# EAGLE design mapleSDuino-V0.9_004-eagle7 (EAGLE 7.6.0)
MAPLE-CUx Large Version
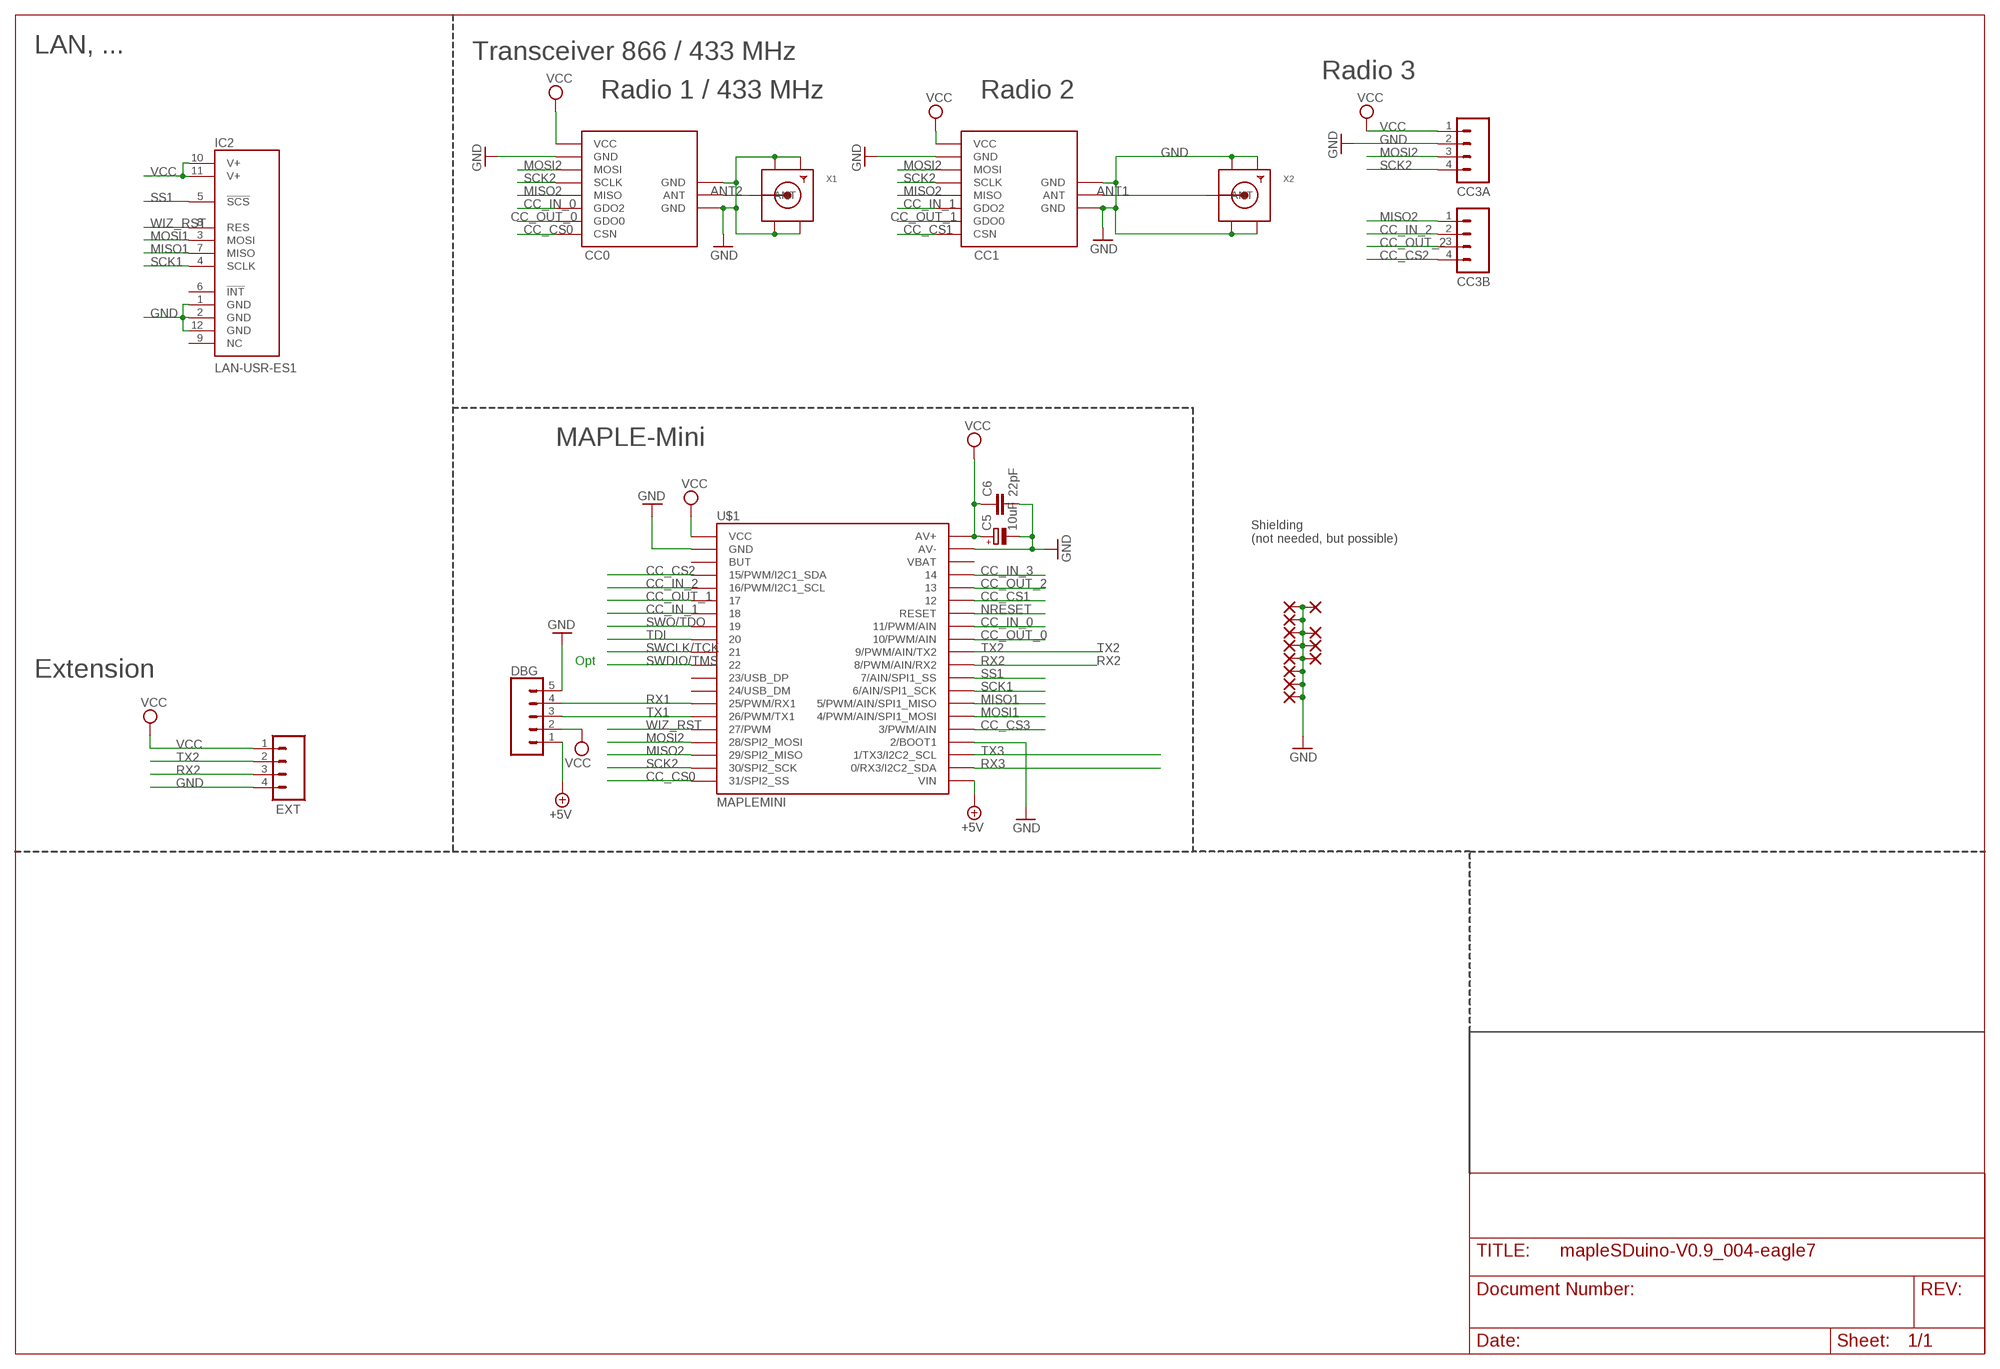
[diagram p0: schematic, sheet 1]

## Parts
C5  10uF  CPOL-EUR/2012-12W  [R/2012-12W]
C6  22pF  C-EUC0805  [C0805]
CC0  CC1101  CC1101_MODULE1SMALL  [CC1101_MODULE1_SMD]
CC1  CC1101_MODULE1SMALL  [CC1101_MODULE1_SMD]
CC3A  CONN_04PTH  [1X04]
CC3B  CONN_04PTH  [1X04]
DBG  CONN_05LOCK  [1X05_LOCK]
EXT  CONN_04PTH  [1X04]
IC2  LAN-USR-ES1  [USR-ES1]
PAD1  WIREPADSMD1,27-254  [SMD1,27-2,54]
PAD2  WIREPADSMD1,27-254  [SMD1,27-2,54]
PAD3  WIREPADSMD1,27-254  [SMD1,27-2,54]
PAD4  WIREPADSMD1,27-254  [SMD1,27-2,54]
PAD5  WIREPADSMD1,27-254  [SMD1,27-2,54]
PAD6  WIREPADSMD1,27-254  [SMD1,27-2,54]
PAD7  WIREPADSMD1,27-254  [SMD1,27-2,54]
PAD8  WIREPADSMD1,27-254  [SMD1,27-2,54]
PAD9  WIREPADSMD1,27-254  [SMD1,27-2,54]
PAD10  WIREPADSMD1,27-254  [SMD1,27-2,54]
PAD11  WIREPADSMD1,27-254  [SMD1,27-2,54]
PAD12  WIREPADSMD1,27-254  [SMD1,27-2,54]
U$1  MAPLEMINI  [20-DIP]
X1  SMACONNECTOR_EDGE  [SMA_EDGELAUNCH]
X2  SMACONNECTOR_EDGE  [SMA_EDGELAUNCH]

## Nets
+5V [PWR]: DBG.1 U$1.21(VIN)
ANT1 [PWR]: CC1.ANT X2.P(ANT)
ANT2: CC0.ANT X1.P(ANT)
CC_CS0: CC0.CSN U$1.20(31/SPI2_SS)
CC_CS1: CC1.CSN U$1.35
CC_CS2: CC3B.4 U$1.4(15/PWM/I2C1_SDA)
CC_CS3: U$1.25(3/PWM/AIN)
CC_IN_0: CC0.GDO2 U$1.33(11/PWM/AIN)
CC_IN_1: CC1.GDO2 U$1.7
CC_IN_2: CC3B.2 U$1.5(16/PWM/I2C1_SCL)
CC_IN_3: U$1.37
CC_OUT_0: CC0.GDO0 U$1.32(10/PWM/AIN)
CC_OUT_1: CC1.GDO0 U$1.6
CC_OUT_2: CC3B.3 U$1.36
GND [PWR]: C5.- C6.2 CC0.GND@0(GND) CC0.GND@1(GND) CC0.GND@2(GND) CC1.GND@0(GND) CC1.GND@1(GND) CC1.GND@2(GND) CC3A.2 DBG.5 EXT.4 IC2.1(GND) IC2.2(GND) IC2.12(GND) PAD1.1(P) PAD2.1(P) PAD3.1(P) PAD4.1(P) PAD5.1(P) PAD6.1(P) PAD7.1(P) PAD8.1(P) PAD9.1(P) PAD10.1(P) PAD11.1(P) PAD12.1(P) U$1.2(GND) U$1.24(2/BOOT1) U$1.39(AV-) X1.GND@1(GND4) X1.GND@2(GND3) X1.GND@3(GND2) X1.GND@4(GND1) X2.GND@1(GND4) X2.GND@2(GND3) X2.GND@3(GND2) X2.GND@4(GND1)
MISO1: IC2.7(MISO) U$1.27(5/PWM/AIN/SPI1_MISO)
MISO2: CC0.MISO CC1.MISO CC3B.1 U$1.18(29/SPI2_MISO)
MOSI1: IC2.3(MOSI) U$1.26(4/PWM/AIN/SPI1_MOSI)
MOSI2: CC0.MOSI CC1.MOSI CC3A.3 U$1.17(28/SPI2_MOSI)
NRESET: U$1.34(RESET)
RX1: DBG.4 U$1.14(25/PWM/RX1)
RX2: EXT.3 U$1.30(8/PWM/AIN/RX2)
RX3: U$1.22(0/RX3/I2C2_SDA)
SCK1: IC2.4(SCLK) U$1.28(6/AIN/SPI1_SCK)
SCK2: CC0.SCLK CC1.SCLK CC3A.4 U$1.19(30/SPI2_SCK)
SS1: IC2.5(!SCS!) U$1.29(7/AIN/SPI1_SS)
SWCLK/TCK: U$1.10
SWDIO/TMS: U$1.11
SWO/TDO: U$1.8
TDI: U$1.9
TX1: DBG.3 U$1.15(26/PWM/TX1)
TX2: EXT.2 U$1.31(9/PWM/AIN/TX2)
TX3: U$1.23(1/TX3/I2C2_SCL)
VCC [PWR]: C5.+ C6.1 CC0.VCC CC1.VCC CC3A.1 DBG.2 EXT.1 IC2.10(V+) IC2.11(V+) U$1.1(VCC) U$1.40(AV+)
WIZ_RST: IC2.8(RES) U$1.16(27/PWM)
Unconnected: IC2.6(!INT!) IC2.9(NC) U$1.3(BUT) U$1.12(23/USB_DP) U$1.13(24/USB_DM) U$1.38(VBAT)

## Notes on the sheet
- LAN, ... | Transceiver 866 / 433 MHz
- Radio 3
- Radio 1 / 433 MHz | Radio 2
- MAPLE-Mini
- Shielding
  (not needed, but possible)
- Opt
- Extension

## Library data of the parts
C5 = rcl:CPOL-EU: POLARIZED CAPACITOR, European symbol
C6 = rcl:C-EU: CAPACITOR, European symbol
CC0 CC1 = Martin-Communication-V4:CC1101_MODULE1: CC1101 wireless module for 433/868 MHz (sold from Aliexpress). DIL version for mounting with pin header (and SMD soldering) and SMD only variant available.
CC3A CC3B EXT = SparkFun-Connectors:CONN_04: Multi connection point. Often used as Generic Header-pin footprint for 0.1 inch spaced/style header connections On any of the 0.1 inch spaced packages, you can populate with these: Break Away Headers - Straight <https://www.sparkfun.com/products/116> (PRT-00116) Break Away Male Headers - Right Angle <https://www.sparkfun.com/products/553> (PRT-00553) Female Headers <https://www.sparkfun.com/products/115> (PRT-00115) Break Away Headers - Machine Pin <https://www.sparkfun.com/products/117> (PRT-00117) Break Away Female Headers - Swiss Machine Pin <https://www.sparkfun.com/products/743> (PRT-00743) For SCREWTERMINALS and SPRING TERMINALS visit here: Screw Terimnals on SparkFun.com <https://www.sparkfun.com/search/results?term=Screw+Terminals> (5mm/3.5mm/2.54mm spacing) This device is also useful as a general connection point to wire up your design to another part of your project. Our various solder wires solder well into these plated through hole pads. Hook-Up Wire - Assortment (Stranded, 22 AWG) <https://www.sparkfun.com/products/11375> (PRT-11375) Hook-Up Wire - Assortment (Solid Core, 22 AWG) <https://www.sparkfun.com/products/11367> (PRT-11367) View the entire wire category on our website here <https://www.sparkfun.com/categories/141> Special notes: Molex polarized connector foot print use with SKU : PRT-08231 with associated crimp pins and housings. 1MM SMD Version SKU: PRT-10208; PROD_ID: CONN-09696
DBG = SparkFun-Connectors:CONN_05: Multi connection point. Often used as Generic Header-pin footprint for 0.1 inch spaced/style header connections On any of the 0.1 inch spaced packages, you can populate with these: Break Away Headers - Straight <https://www.sparkfun.com/products/116> (PRT-00116) Break Away Male Headers - Right Angle <https://www.sparkfun.com/products/553> (PRT-00553) Female Headers <https://www.sparkfun.com/products/115> (PRT-00115) Break Away Headers - Machine Pin <https://www.sparkfun.com/products/117> (PRT-00117) Break Away Female Headers - Swiss Machine Pin <https://www.sparkfun.com/products/743> (PRT-00743) For SCREWTERMINALS and SPRING TERMINALS visit here: Screw Terimnals on SparkFun.com <https://www.sparkfun.com/search/results?term=Screw+Terminals> (5mm/3.5mm/2.54mm spacing) This device is also useful as a general connection point to wire up your design to another part of your project. Our various solder wires solder well into these plated through hole pads. Hook-Up Wire - Assortment (Stranded, 22 AWG) <https://www.sparkfun.com/products/11375> (PRT-11375) Hook-Up Wire - Assortment (Solid Core, 22 AWG) <https://www.sparkfun.com/products/11367> (PRT-11367) View the entire wire category on our website here <https://www.sparkfun.com/categories/141> Special notes: Molex polarized connector foot print use with SKU : PRT-08231 with associated crimp pins and housings. 1MM SMD Version SKU: PRT-10208
IC2 = Martin-Communication:LAN-USR-ES1
PAD1-PAD12 = wirepad:WIREPAD: Wire PAD connect wire on PCB
U$1 = maplemini-small:MAPLEMINI
X1 X2 = adafruit:SMACONNECTOR: SMA Connector 90° DIP SMA Connector, 50 Ohm (4UConnector: 07259)

## Net classes
0 default: width 0.305 mm
1 PWR: width 0.406 mm

## Board
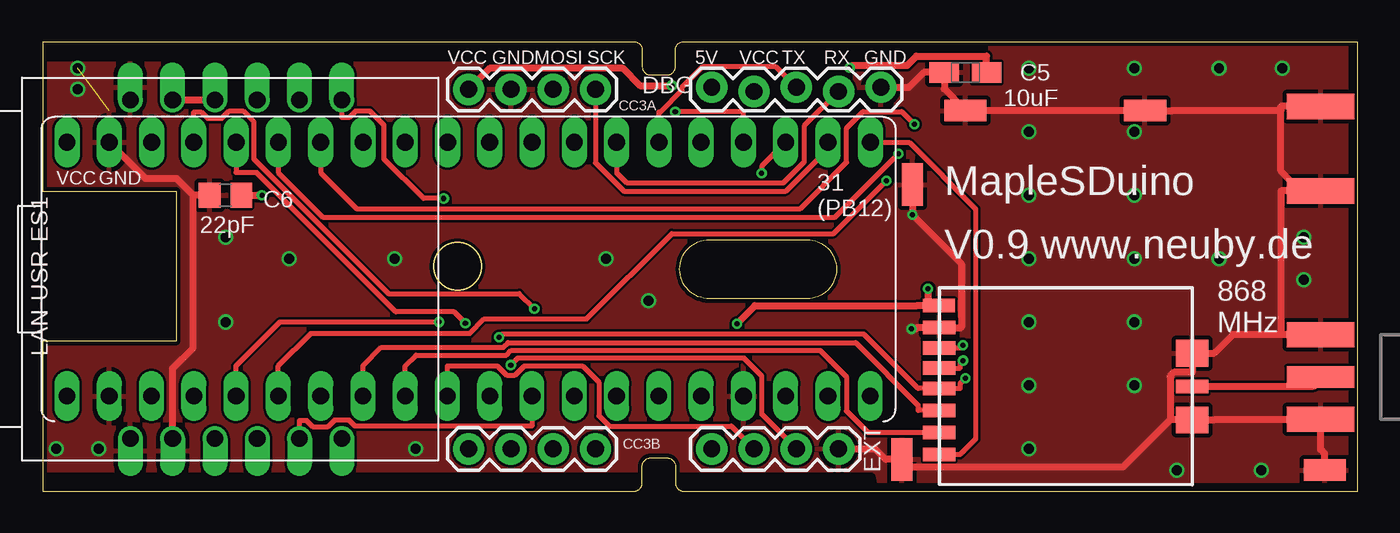
[diagram p1: board, top side]
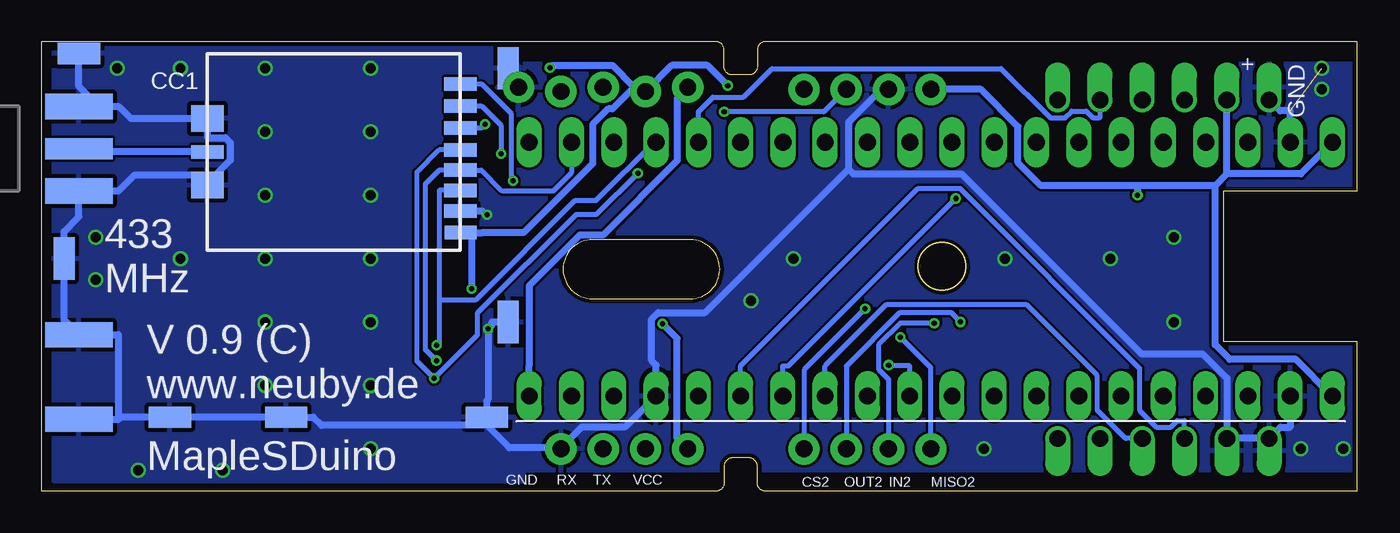
[diagram p2: board, bottom side, seen from below]

Size 79 x 27 mm. Coordinates in mm from the lower left corner, seen from the top.
Outline: 0,0 35.5,0 arc90 36,0.5 36,1.5 arc-90 36.5,2 37.5,2 arc-90 38,1.5 38,0.5 arc90 38.5,0 79,0 79,27 38.5,27 arc90 38,26.5 38,25.5 arc-90 37.5,25 36.5,25 arc-90 36,25.5 36,26.5 arc90 35.5,27 0,27 0,18 8,18 8,9 0,9 0,0
Outline: 40.04,15.11 45.9,15.11 arc-180 45.9,11.56 40.04,11.56 arc-180 40.04,15.11
Outline: circle at 24.9,13.51 radius 1.41
Copper layers (1*16): Top 0.035mm / dielectric 1.5mm / Bottom 0.035mm
Design rules "Fusion_eagle_rule_v1.1": minimum track width 6mil, minimum drill 12mil, track to track 6mil, track to pad 6mil, pad to pad 6mil, via to via 6mil, smd to smd 0mil, copper to edge 10mil, drill to drill 10mil, minimum pad ring 10mil, minimum via ring 6mil, stop-mask expansion 2mil, vias tented up to drill 100mil, thermal gap 10mil
tRestrict: 8 lines
bRestrict: 8 lines

### Footprints (pad centres in the part's own frame; a part is rotated, then mirrored left to right if it is on the bottom)
R/2012-12W = smd 1.75 x 1.26: + 1.275,0; - -1.275,0
C0805 = smd 1.3 x 1.5: 1 -0.95,0; 2 0.95,0
CC1101_MODULE1_SMD = smd 1.93 x 0.813: ANT 14.889,4.381; CSN -0.305,0.305; GDO0 -0.305,1.626; GDO2 -0.305,2.946; GND@0 -0.305,7.925; MISO -0.305,4.267; MOSI -0.305,6.706; SCLK -0.305,5.486; VCC -0.318,9.238 | smd 1.93 x 1.6: GND@1 14.889,6.381; GND@2 14.889,2.381
1X04 = drill 1.016 pad 1.88: 1 0,0; 2 2.54,0; 3 5.08,0; 4 7.62,0
1X05_LOCK = drill 1.016 pad 1.88: 1 0,0.127; 2 2.54,-0.127; 3 5.08,0.127; 4 7.62,-0.127; 5 10.16,0.127
USR-ES1 = drill 1 pad 1.35 offset: 1 -10.16,5.715; 2 -10.16,3.175; 3 -10.16,0.635; 4 -10.16,-1.905; 5 -10.16,-4.445; 6 -10.16,-6.985; 7 10.16,-6.985; 8 10.16,-4.445; 9 10.16,-1.905; 10 10.16,0.635; 11 10.16,3.175; 12 10.16,5.715
SMD1,27-2,54 = smd 1.27 x 2.54: 1 0,0
20-DIP = drill 1.016 pad 1.27 long: 1 -24.13,-7.62; 2 -21.59,-7.62; 3 -19.05,-7.62; 4 -16.51,-7.62; 5 -13.97,-7.62; 6 -11.43,-7.62; 7 -8.89,-7.62; 8 -6.35,-7.62; 9 -3.81,-7.62; 10 -1.27,-7.62; 11 1.27,-7.62; 12 3.81,-7.62; 13 6.35,-7.62; 14 8.89,-7.62; 15 11.43,-7.62; 16 13.97,-7.62; 17 16.51,-7.62; 18 19.05,-7.62; 19 21.59,-7.62; 20 24.13,-7.62 | drill 1 pad 1.27 long: 21 24.13,7.62; 22 21.59,7.62; 23 19.05,7.62; 24 16.51,7.62; 25 13.97,7.62; 26 11.43,7.62; 27 8.89,7.62; 28 6.35,7.62; 29 3.81,7.62; 30 1.27,7.62; 31 -1.27,7.62; 32 -3.81,7.62; 33 -6.35,7.62; 34 -8.89,7.62; 35 -11.43,7.62; 36 -13.97,7.62; 37 -16.51,7.62; 38 -19.05,7.62; 39 -21.59,7.62; 40 -24.13,7.62
SMA_EDGELAUNCH = smd 4.064 x 1.524: GND@1 2.032,-2.54; GND@2 2.032,2.54 | smd 4.064 x 1.524 bottom: GND@3 2.032,2.54; GND@4 2.032,-2.54 | smd 4.064 x 1.27: P 2.032,0

### Placement (x,y rotation side)
C5  55.42,25.15 0 top
C6  10.97,17.78 180 top
CC0  54.15,1.91 0 top
CC1  54.15,24.77 180 bottom
CC3A  25.57,24.13 0 top
CC3B  25.57,2.54 0 top
DBG  40.18,24.13 0 top
EXT  40.18,2.54 0 top
IC2  10.97,13.34 90 top
PAD1  52.24,18.41 0 top
PAD2  77.01,1.27 90 top
PAD3  55.42,22.86 90 top
PAD4  71.3,4.45 270 bottom
PAD5  66.22,22.86 90 top
PAD6  51.61,1.91 0 top
PAD7  64.31,4.45 270 bottom
PAD8  50.98,10.16 0 bottom
PAD9  76.76,26.29 270 bottom
PAD10  77.64,13.97 0 bottom
PAD11  52.24,4.45 270 bottom
PAD12  50.98,25.4 180 bottom
U$1  25.57,13.34 180 bottom
X1  78.79,6.86 180 top
X2  78.79,20.57 0 bottom

### Tracks (layer width: path | path; a pad name or v marks a point on that pad's centre or on a via)
+5V
  Bottom 0.406: DBG.1 40.81,23.62 40.81,19.85 45.29,15.38 46.67,15.38 49.7,12.35 49.7,7.58 U$1.21
ANT1
  Bottom 0.406: CC1.ANT 76.76,20.38 X2.P
ANT2
  Top 0.406: X1.P arc-90 76.18,6.29 CC0.ANT
CC_CS0
  Top 0.305: CC0.CSN 55.12,2.21 56.03,3.13 56.03,16.96 52.04,20.95 U$1.20
CC_CS1  (via drill 0.3 pad 0.61)
  Top 0.305: v50.68,18.64 47.5,15.47 37.79,15.47 32.66,10.35 26.51,10.35 25.65,9.48 16.1,9.48 14.14,7.53 U$1.35
  Bottom 0.305: CC1.CSN 52.58,24.46 50.77,22.66 50.77,18.74 v50.68,18.64
CC_CS2  (via drill 0.3 pad 0.61)
  Top 0.305: U$1.4 9.06,22.78 9.51,22.78 9.9,22.39 10.75,22.39 11.2,22.84 12.02,22.84 12.67,22.18 12.67,19.95 20.76,11.87 28.61,11.87 v29.52,10.96
  Bottom 0.305: v29.52,10.96 33.2,7.29 CC3B.4
CC_IN_0
  Top 0.305: CC0.GDO2 52.58,4.85 52.58,5.18 48.83,8.92 27.94,8.92 27.66,8.63 20.33,8.63 19.23,7.53 U$1.33
CC_IN_1  (via drill 0.3 pad 0.61)
  Top 0.305: U$1.7 16.68,19.13 18.84,16.97 45.5,16.97 48.28,19.75 48.28,21.8 49.28,22.8 51.6,22.8 v52.36,22.03
  Bottom 0.305: v52.36,22.03 52.58,21.82 CC1.GDO2
CC_IN_2  (via drill 0.3 pad 0.61)
  Top 0.305: v25.38,10.09 24.7,10.78 21.2,10.78 12.85,19.13 11.61,19.13 U$1.5
  Bottom 0.305: v25.38,10.09 27.42,10.09 28.72,8.79 28.72,7.32 28.11,6.72 | 28.11,6.72 | 28.11,6.72 CC3B.2
CC_OUT_0
  Top 0.305: CC0.GDO0 49.56,3.53 48.27,4.82 48.27,6.88 46.69,8.46 28.13,8.46 27.85,8.18 22.41,8.18 21.77,7.53 U$1.32
CC_OUT_1  (via drill 0.3 pad 0.61)
  Top 0.305: v51.4,20.27 47.6,16.47 16.8,16.47 14.14,19.13 U$1.6
  Bottom 0.305: v51.4,20.27 51.4,21.97 52.58,23.14 CC1.GDO0
CC_OUT_2  (via drill 0.3 pad 0.61)
  Top 0.305: v23.8,10.17 14.24,10.17 11.61,7.53 U$1.36
  Bottom 0.305: v23.8,10.17 24.34,10.71 27.45,10.71 30.66,7.5 CC3B.3
GND  (via drill 0.3 pad 0.61, 0.6)  (1 unrouted)
  Top 0.406: 76.76,4.29 X1.GND@2 | 76.76,4.29 76.76,2.52 77.01,2.26 PAD2.1 | 76.76,4.29 70.36,4.29 CC0.GND@2 67.72,4.29 | 67.72,4.29 67.72,6.89 67.96,7.13 69.04,7.13 CC0.GND@1 70.36,8.29 71.47,9.4 74.37,9.4 | 67.72,4.29 64.88,1.45 52.07,1.45 PAD6.1 50.62,1.91 49.98,2.54 EXT.4 | v52.18,9.74 52.44,9.74 52.52,9.83 CC0.GND@0 55.17,9.83 55.17,13.68 v52.24,16.6 PAD1.1 | PAD3.1 55.42,22.88 54.15,24.16 C5.- 52.91,25.15 52.02,24.26 DBG.5 | PAD3.1 PAD5.1 67.03,22.86 67.84,22.86 74.37,22.86 | PAD3.1 | 74.37,22.86 74.37,23.11 X2.GND@2 | 75.56,18.03 74.37,19.23 74.37,22.86 | 75.56,18.03 74.37,18.03 74.37,9.4 | X2.GND@1 75.56,18.03 | 74.37,9.4 74.51,9.4 X1.GND@1 | IC2.2 7.79,7.37 9.01,8.59 9.01,17.78 | C6.2 9.01,17.78 | U$1.2 6.16,18.78 8.01,18.78 9.01,17.78
  Bottom 0.406: DBG.5 50.98,24.89 PAD12.1 | 30.52,19.34 39.13,10.72 41.97,10.72 42.35,10.34 42.35,7.85 42.09,7.58 U$1.24 43.96,3.84 46.55,3.84 47.8,2.6 | 47.8,2.6 50.89,2.6 52.24,3.95 | 47.8,2.6 EXT.4 | 30.52,19.34 30.24,19.05 23.73,19.05 12.92,8.24 9.25,8.24 7.79,6.79 IC2.2 IC2.1 4.58,3.85 3.99,3.85 U$1.39 | CC3A.2 28.56,24.13 30.52,22.17 30.52,19.34 | U$1.2 3.99,22.84 4.59,22.84 IC2.12 | 74.37,4.32 74.24,4.45 PAD4.1 PAD7.1 62.68,4.45 62.19,3.95 52.24,3.95 | 69.04,18.96 68.57,18.96 67.67,19.86 67.67,20.94 67.95,21.23 69.04,21.23 CC1.GND@2 73.64,22.38 74.37,23.11 75.56,23.11 | 52.24,3.95 PAD11.1 52.24,5.44 52.18,5.5 v52.18,9.74 51.97,9.96 51.97,10.16 PAD8.1 | CC1.GND@0 52.52,16.84 52.28,16.6 v52.24,16.6 | 75.56,23.11 76.76,24.31 PAD9.1 | X2.GND@2 75.56,23.11 | 69.04,18.96 73.44,18.96 74.37,18.03 X2.GND@1 76.76,16.48 77.64,15.6 PAD10.1 77.64,10.29 X1.GND@1 74.37,9.4 74.37,4.32 | CC1.GND@1 69.04,18.96 | X1.GND@2 74.37,4.32
  other vias: 2.08,25.4 2.08,24.13 0.81,2.54 3.35,2.54 10.97,10.16 10.97,15.24 14.78,13.97 21.13,13.97 22.4,2.54 33.83,13.97 36.37,11.43 59.23,2.54 59.23,6.35 59.23,10.16 59.23,13.97 59.23,17.78 59.23,21.59 59.23,25.4 65.58,25.4 65.58,21.59 65.58,17.78 65.58,13.97 65.58,10.16 65.58,6.35 68.12,1.27 73.2,1.27 75.74,12.7 75.74,15.24 74.47,25.4 70.66,25.4 70.66,13.97
  pour Top: 0.17,26.67 78.28,26.67 78.28,0.64 0.17,0.64
  pour Bottom: 0.17,26.67 78.28,26.67 78.28,0.64 0.17,0.64
MISO1  (via drill 0.3 pad 0.61)
  Top 0.305: IC2.7 17.95,22.44 18.39,22.44 18.78,22.82 19.66,22.82 20.5,21.98 20.5,19.94 22.86,17.58 v24.08,17.58
  Bottom 0.305: U$1.27 34.47,7.53 34.13,7.53 v24.08,17.58
MISO2  (via drill 0.3 pad 0.61)
  Top 0.305: v27.41,9.24 27.6,9.44 49.31,9.44 52.58,6.17 53.33,6.17 CC0.MISO 55.12,6.17 55.12,6.47 v55.42,6.78 | U$1.18 43.18,19.51 v43.18,19.11
  Bottom 0.305: CC3B.1 25.57,7.42 v27.41,9.24 | v43.18,19.11 45.68,16.61 46.89,16.61 52.82,10.67 52.82,9.38 v55.42,6.78 56.45,7.81 56.45,19.16 55.12,20.5 CC1.MISO
MOSI1
  Bottom 0.305: IC2.3 10.34,4.23 10.77,4.23 11.16,3.85 12.02,3.85 13.04,4.87 13.04,7.4 23.83,18.19 26.34,18.19 37.01,7.53 U$1.26
MOSI2  (via drill 0.3 pad 0.61)
  Top 0.305: v37.99,22.78 42.09,22.78 U$1.17 | v55.28,8.77 55.12,8.61 CC0.MOSI
  Bottom 0.305: CC3A.3 32,22.78 v37.99,22.78 | 55.12,11.5 55.12,8.93 v55.28,8.77 | 55.12,11.5 55.12,18.06 CC1.MOSI | 55.12,11.5 52.91,11.5 46.95,17.46 45.68,17.46 42.19,20.95 U$1.17
RX1
  Top 0.305: DBG.4 45.73,21.94 45.73,19.77 44.46,18.5 35.1,18.5 34.47,19.13 U$1.14
RX2  (via drill 0.3 pad 0.61)
  Top 0.305: EXT.3 43.19,4.61 43.19,6.92 42.12,7.99 28.52,7.99 v28.11,7.58
  Bottom 0.305: v28.11,7.58 28.06,7.53 26.84,7.53 U$1.30
SCK1
  Bottom 0.305: IC2.4 13.89,3.17 15.58,4.87 15.58,6.95 19.81,11.18 28.27,11.18 31.92,7.53 U$1.28
SCK2  (via drill 0.3 pad 0.61)
  Top 0.305: CC3A.4 33.2,19.72 34.9,18.02 44.63,18.02 47.16,20.55 U$1.19 | v55.28,7.84 55.12,7.68 55.12,7.39 CC0.SCLK
  Bottom 0.305: v55.28,7.84 55.93,8.49 55.93,18.46 55.12,19.28 CC1.SCLK 52.58,19.28 51.32,18.03 48.27,18.03 47.16,19.13 U$1.19
SS1
  Top 0.305: IC2.5 15.41,4.23 15.85,4.23 16.24,3.85 17.1,3.85 17.51,4.26 18.4,4.26 18.76,3.9 29.38,3.9 U$1.29
TX1
  Top 0.305: U$1.15 37.01,22.78 37.12,22.78 38.4,24.07 38.4,24.25 39.67,25.52 44,25.52 DBG.3
TX2
  Top 0.305: 28.92,7.53 28.36,6.97 27.86,6.97 27.3,7.53 24.3,7.53 U$1.31 | 28.92,7.53 | 28.92,7.53 32.41,7.53 33.41,6.54 33.41,4.52 34.03,3.9 41.36,3.9 EXT.2
VCC  (via drill 0.3 pad 0.61)
  Top 0.406: v48.47,25.43 48.62,25.58 51.92,25.58 52.48,26.13 56.7,26.13 C5.+ | CC3A.1 26.88,25.43 34.81,25.43 35.88,24.36 v37.78,24.36 | v53.18,12.16 53.18,11.14 | 53.18,11.14 52.51,11.14 42.77,11.14 v41.69,10.06 | CC0.VCC 53.18,11.14 | v13.16,17.78 12.93,17.78 C6.1 | IC2.11 IC2.10
  Bottom 0.406: 43.4,24.27 44.7,22.96 44.96,22.96 45.9,22.03 45.9,19.67 50.04,15.53 52.51,15.53 53.17,15.53 | 43.4,24.27 42.99,24.27 DBG.2 41.15,25.58 38.99,25.58 v37.78,24.36 | 43.4,24.27 44.68,25.55 48.34,25.55 v48.47,25.43 | 53.17,15.53 53.18,15.52 v53.18,12.16 | CC1.VCC 53.17,15.53 | 13.16,18.35 18.96,18.35 20.34,19.73 20.34,21.89 22.58,24.13 CC3A.1 | 8.5,18.35 13.16,18.35 | 13.16,18.35 v13.16,17.78 | EXT.1 40.81,3.17 40.81,9.19 v41.69,10.06 | 8.5,18.35 7.79,19.05 | U$1.40 3.64,7.92 7.62,7.92 8.5,8.79 8.5,18.35 | 7.79,19.05 IC2.11 | U$1.1 3.35,19.05 7.79,19.05
WIZ_RST
  Bottom 0.305: IC2.8 15.41,22.44 15.85,22.44 16.24,22.82 17.11,22.82 17.52,22.41 18.39,22.41 21.36,25.38 35.12,25.38 36.84,23.66 38.66,23.66 39.55,22.78 U$1.16

### Text on the board
tNames: VCC | GND | MOSI | SCK | 5V | VCC | TX | RX | GND | C5 | 10uF | 31 / (PB12) | VCC | GND | C6 | MapleSDuino | 22pF | V0.9 www.neuby.de | 868 / MHz | LAN-USR-ES1
bNames: GND | + | CC1 | 433 / MHz | V 0.9 (C) / www.neuby.de | MapleSDuino | MISO2 | IN2 | OUT2 | CS2 | VCC | TX | RX | GND